# Altium schematic sheet AD8253.SchDoc
size A4
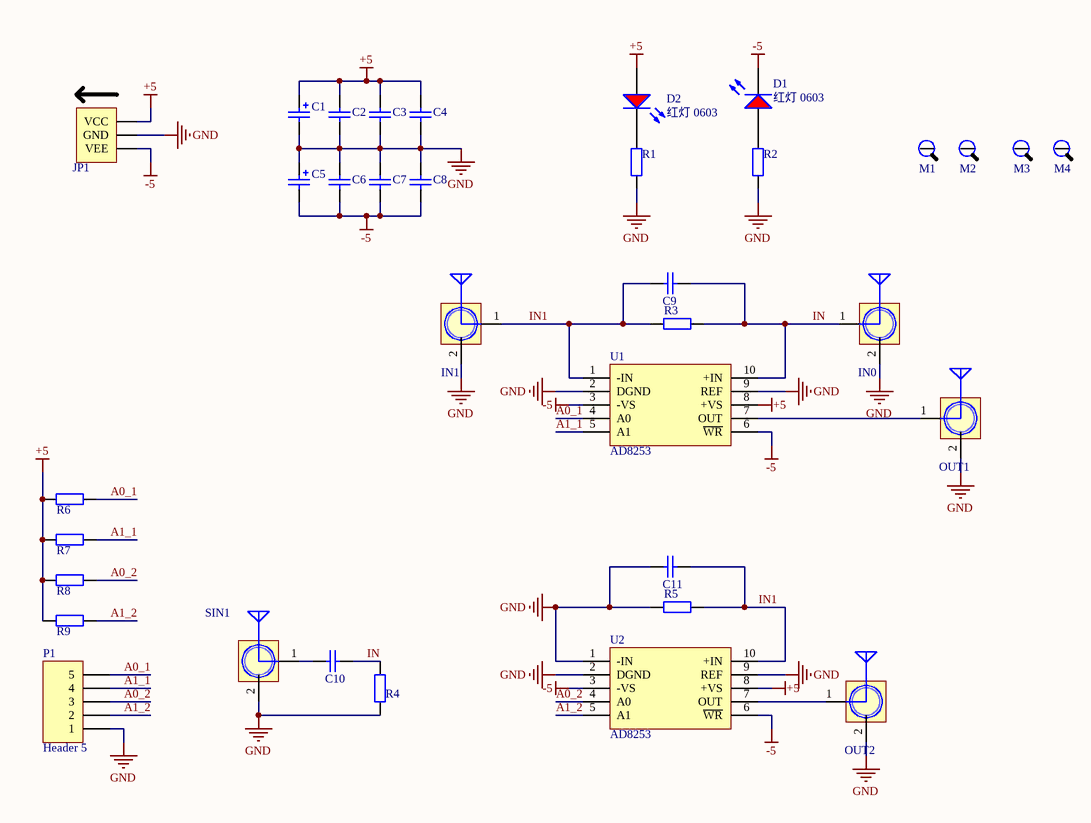
[diagram p0: AD8253.SchDoc]

## Parts
C1  10uF (106) ±10% 16V  [CASE-A_3216]  (value not drawn)
C2  100nF (104) 10% 50V  [0603_C]  (value not drawn)
C3  100nF (104) 10% 50V  [0603_C]  (value not drawn)
C4  100nF (104) 10% 50V  [0603_C]  (value not drawn)
C5  10uF (106) ±10% 16V  [CASE-A_3216]  (value not drawn)
C6  100nF (104) 10% 50V  [0603_C]  (value not drawn)
C7  100nF (104) 10% 50V  [0603_C]  (value not drawn)
C8  100nF (104) 10% 50V  [0603_C]  (value not drawn)
C9  1.5nF (152) 10% 50V  [0603_C]  (value not drawn)
C10  1.5nF (152) 10% 50V  [0603_C]  (value not drawn)
C11  1.5nF (152) 10% 50V  [0603_C]  (value not drawn)
D1  红灯 0603  [0603_LED_S1]
D2  红灯 0603  [0603_LED_S1]
IN0  SMA WIFI 天线接口  [SMA]  (value not drawn)
IN1  SMA WIFI 天线接口  [SMA]  (value not drawn)
JP1  HDR-1X3  [Power_IN_3.81-3P]  (value not drawn)
M1  M3  [M3x10_L]  (value not drawn)
M2  M3  [M3x10_L]  (value not drawn)
M3  M3  [M3x10_L]  (value not drawn)
M4  M3  [M3x10_L]  (value not drawn)
OUT1  SMA WIFI 天线接口  [SMA]  (value not drawn)
OUT2  SMA WIFI 天线接口  [SMA]  (value not drawn)
P1  Header 5  [HDR1X5]
R1  10KΩ (1002) ±1%  [0603_R]  (value not drawn)
R2  10KΩ (1002) ±1%  [0603_R]  (value not drawn)
R3  110Ω (1100) ±1%  [0603_R]  (value not drawn)
R4  110Ω (1100) ±1%  [0603_R]  (value not drawn)
R5  110Ω (1100) ±1%  [0603_R]  (value not drawn)
R6  110Ω (1100) ±1%  [0603_R]  (value not drawn)
R7  110Ω (1100) ±1%  [0603_R]  (value not drawn)
R8  110Ω (1100) ±1%  [0603_R]  (value not drawn)
R9  110Ω (1100) ±1%  [0603_R]  (value not drawn)
SIN1  SMA WIFI 天线接口  [SMA]  (value not drawn)
U1  AD8253  [MSOP10_M]
U2  AD8253  [MSOP10_M]

## Nets
+5: C1.1 C2.2 C3.2 C4.2 D2.A JP1.1(VCC) R6.2 R7.2 R8.2 R9.2 U1.8(+VS) U2.8(+VS)
-5: C5.2 C6.1 C7.1 C8.1 D1.K JP1.3(VEE) U1.3(-VS) U1.6(~{WR}) U2.3(-VS) U2.6(~{WR})
GND: C1.2 C2.1 C3.1 C4.1 C5.1 C6.2 C7.2 C8.2 C11.2 IN0.2 IN1.2 JP1.2(GND) OUT1.2 OUT2.2 P1.1 R1.1 R2.1 R4.1 R5.1 SIN1.2 U1.2(DGND) U1.9(REF) U2.1(-IN) U2.2(DGND) U2.9(REF)
A0_1: P1.5 R6.1 U1.4(A0)
A0_2: P1.3 R8.1 U2.4(A0)
A1_1: P1.4 R7.1 U1.5(A1)
A1_2: P1.2 R9.1 U2.5(A1)
IN: C9.1 C10.1 IN0.1(SINGLE) R3.2 R4.2 U1.10(+IN)
IN1: C9.2 C11.1 IN1.1(SINGLE) R3.1 R5.2 U1.1(-IN) U2.10(+IN)
NetC10_2: C10.2 SIN1.1(SINGLE)
NetD1_A: D1.A R2.2
NetD2_K: D2.K R1.2
NetOUT1_1: OUT1.1(SINGLE) U1.7(OUT)
NetOUT2_1: OUT2.1(SINGLE) U2.7(OUT)

Not connected (* = marked no-connect by the designer): M1 1; M2 1; M3 1; M4 1

## Library data of the parts
C1 C5 = 3216 10uF (106) 10% 16V: 钽电容; ComponentLink1Description: 供应商链接; ComponentLink1URL: http://www.szlcsc.com/product/details_7643.html; Package: 3216; Supplier: LC; SuppliersPartNumber: C7171
C2-C4 C6-C8 = 0603 100nF (104) 10% 50V: 贴片电容; ComponentLink1Description: 供应商链接; ComponentLink1URL: http://www.szlcsc.com/product/details_15331.html; Package: 0603; Supplier: LC; SuppliersPartNumber: C14663
C9-C11 = 0603 1.5nF (152) 10% 50V: 贴片电容; ComponentLink1Description: 供应商链接; ComponentLink1URL: http://www.szlcsc.com/product/details_1947.html; Package: 0603; Supplier: LC; SuppliersPartNumber: C1595
D1 D2 = 0603 红灯: 发光二极管; ComponentLink1Description: 供应商链接; ComponentLink1URL: http://www.szlcsc.com/product/details_2659.html; Package: 0603; Supplier: LC; SuppliersPartNumber: C2286
IN0 IN1 OUT1 OUT2 SIN1 = PORT_SMA: SMA-2.4G射频天线接口; 版权归属: 源创客; BOM名称: SMA-2.4G射频天线接口; 学习资源: www.ooocke.com
JP1 = PORT_Power_IN3: 3P接插件,模块双电源供电口; 版权归属: 源创客; BOM名称: 3P接插件; 学习资源: www.ooocke.com
M1-M4 = ELSE_M3_screw: 螺丝
P1 = Header 5: Header, 5-Pin; LatestRevisionDate: 17-Jul-2002; LatestRevisionNote: Re-released for DXP Platform.; Publisher: Altium Limited
R1 R2 = 0603 10KΩ (1002) 1%: 贴片电阻; ComponentLink1Description: 供应商链接; ComponentLink1URL: http://www.szlcsc.com/product/details_26547.html; Package: 0603; Supplier: LC; SuppliersPartNumber: C25804
R3-R9 = 0603 110Ω (1100) 1%: 贴片电阻; ComponentLink1Description: 供应商链接; ComponentLink1URL: http://www.szlcsc.com/product/details_23508.html; Package: 0603; Supplier: LC; SuppliersPartNumber: C22781